# EAGLE design 211_7seg_1_0_7 (EAGLE 9.2.2)
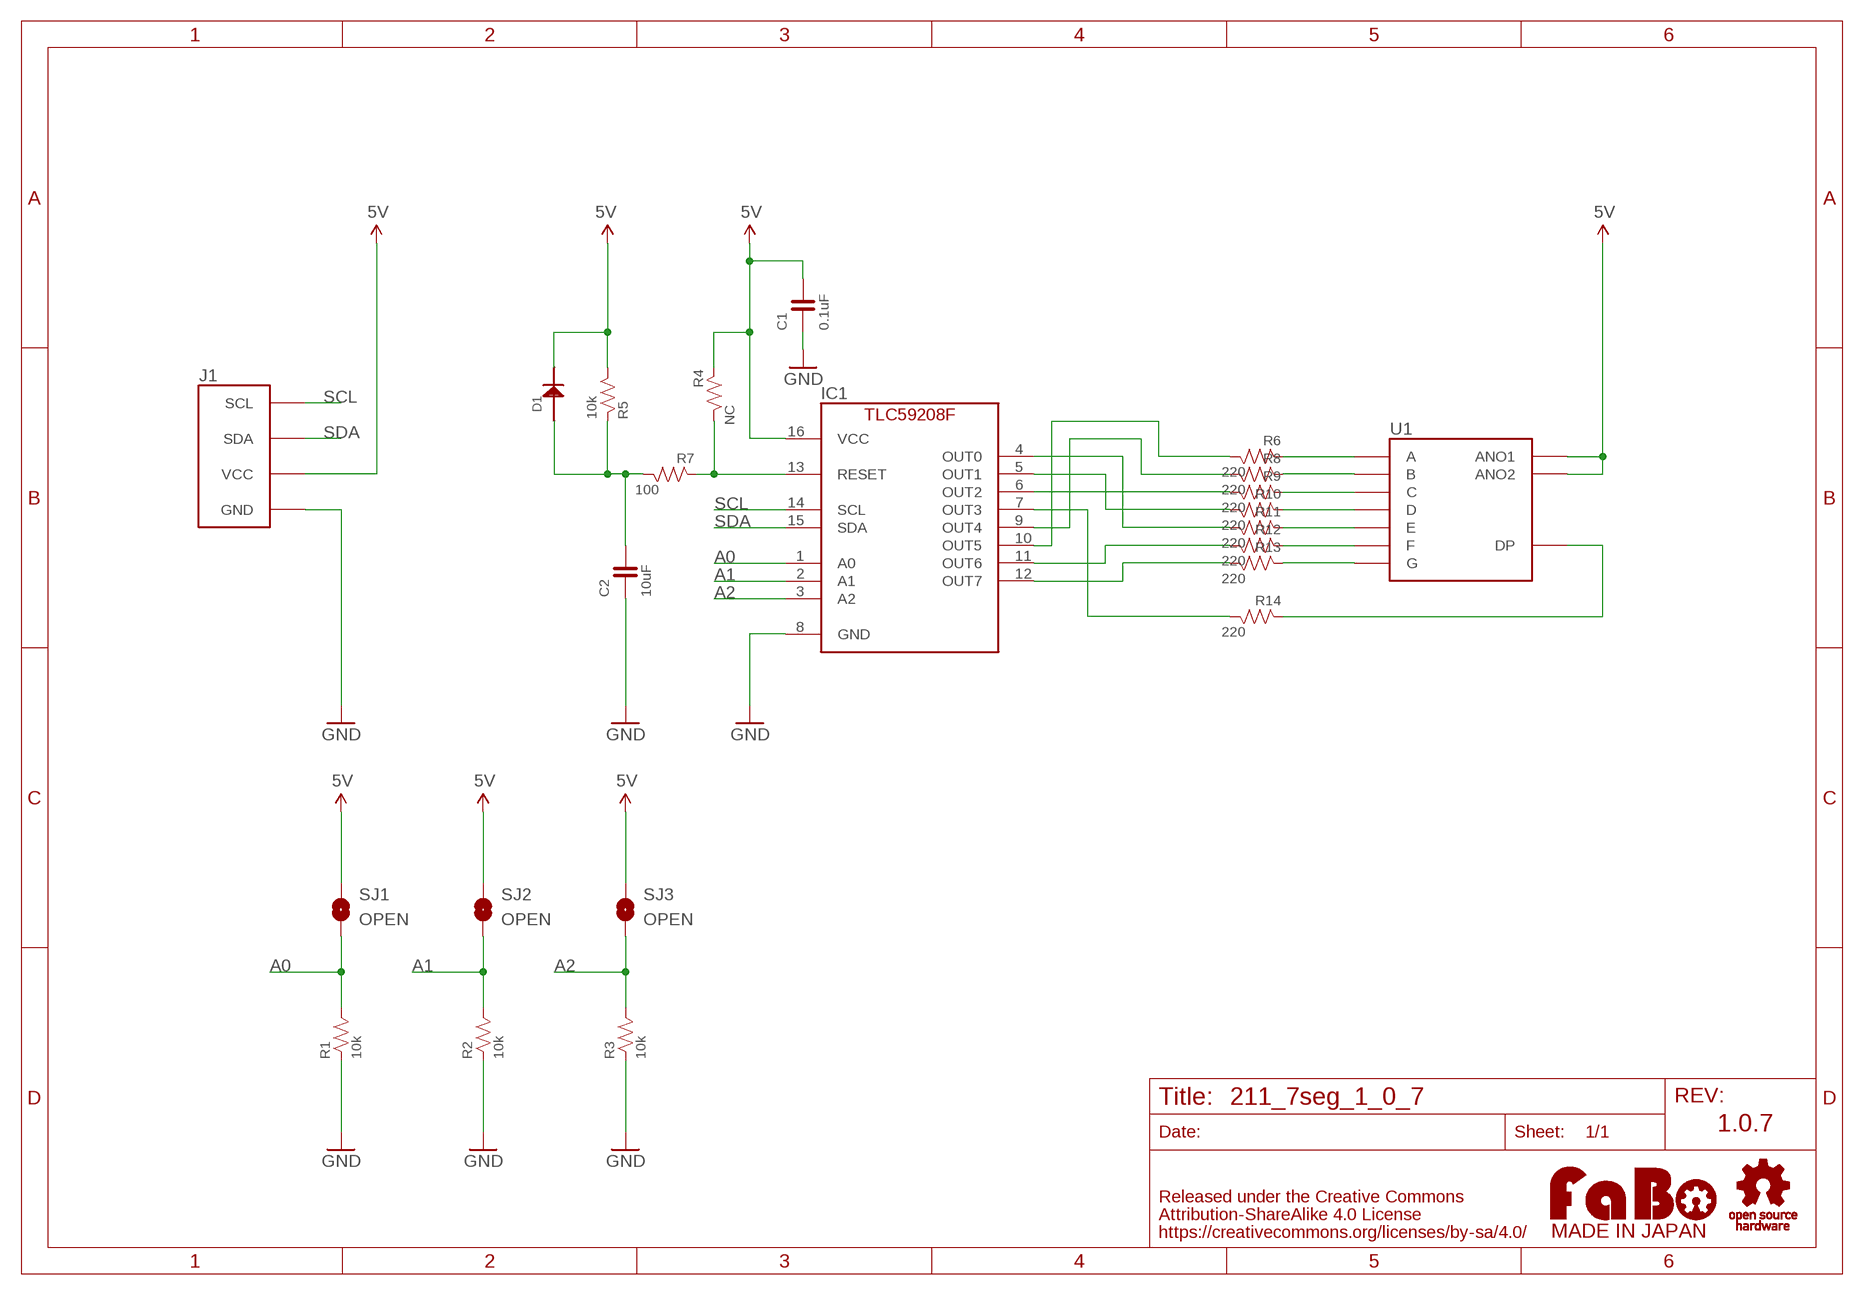
[diagram p0: schematic, sheet 1]

## Parts
C1  0.1uF  CAPACITOR-0603  [0603]
C2  10uF  CAPACITOR-0603  [0603]
D1  1N4148  [1N4148W]
IC1  TLC59208FIPWR  [TSSOP16]
J1  FABO_BRICK_I2C  [FABO_BRICK_I2C]
R1  10k  RESISTOR-0603  [0603]
R2  10k  RESISTOR-0603  [0603]
R3  10k  RESISTOR-0603  [0603]
R4  NC  RESISTOR-0603  [0603]
R5  10k  RESISTOR-0603  [0603]
R6  220  RESISTOR-0603  [0603]
R7  100  RESISTOR-0603  [0603]
R8  220  RESISTOR-0603  [0603]
R9  220  RESISTOR-0603  [0603]
R10  220  RESISTOR-0603  [0603]
R11  220  RESISTOR-0603  [0603]
R12  220  RESISTOR-0603  [0603]
R13  220  RESISTOR-0603  [0603]
R14  220  RESISTOR-0603  [0603]
SJ1  OPEN  SMD-JUMPER-2-OPEN  [SMD-JUMPER-2-OPEN]
SJ2  OPEN  SMD-JUMPER-2-OPEN  [SMD-JUMPER-2-OPEN]
SJ3  OPEN  SMD-JUMPER-2-OPEN  [SMD-JUMPER-2-OPEN]
U1  7SEG_ANO  [A-551SRD]
U$2  LOGO_OSHW-M_BOTTOM  [LOGO_OSHW_M_BOTTOM]
U$4  LOGO_FABO-M  [LOGO_FABO_MS]

## Nets
5V: C1.2 D1.CATHODE IC1.16(VCC) J1.VCC R4.1 R5.2 SJ1.1 SJ2.1 SJ3.1 U1.ANO1 U1.ANO2
A0: IC1.1(A0) R1.2 SJ1.2
A1: IC1.2(A1) R2.2 SJ2.2
A2: IC1.3(A2) R3.2 SJ3.2
GND: C1.1 C2.1 IC1.8(GND) J1.GND R1.1 R2.1 R3.1
N$1: IC1.4(OUT0) R11.2
N$2: IC1.5(OUT1) R10.2
N$3: R9.1 U1.C
N$4: IC1.7(OUT3) R14.2
N$5: IC1.9(OUT4) R8.2
N$6: IC1.10(OUT5) R6.2
N$7: IC1.11(OUT6) R12.2
N$8: IC1.12(OUT7) R13.2
N$9: C2.2 D1.ANODE R5.1 R7.2
N$10: IC1.13(RESET) R4.2 R7.1
N$11: R6.1 U1.A
N$12: R8.1 U1.B
N$13: IC1.6(OUT2) R9.2
N$14: R10.1 U1.D
N$15: R11.1 U1.E
N$16: R12.1 U1.F
N$17: R13.1 U1.G
N$18: R14.1 U1.DP
SCL: IC1.14(SCL) J1.SCL
SDA: IC1.15(SDA) J1.SDA

## Notes on the sheet
- 1.0.7

## Library data of the parts
C1 C2 = FaBo-Capacitor:CAPACITOR: CAPACITOR
D1 = FaBo-Diode:1N4148
IC1 = FaBo-LED:TLC59208F
J1 = FaBo-Template:FABO_BRICK_I2C: FaBo Brick I2C
R1-R14 = FaBo-Resistors:RESISTOR: RESISTOR
SJ1-SJ3 = FaBo-Supply:SMD-JUMPER-2
U1 = FaBo-LED:7SEG_ANO
U$2 = FaBo-etc:LOGO_OSHW
U$4 = FaBo-etc:LOGO_FABO

## Board
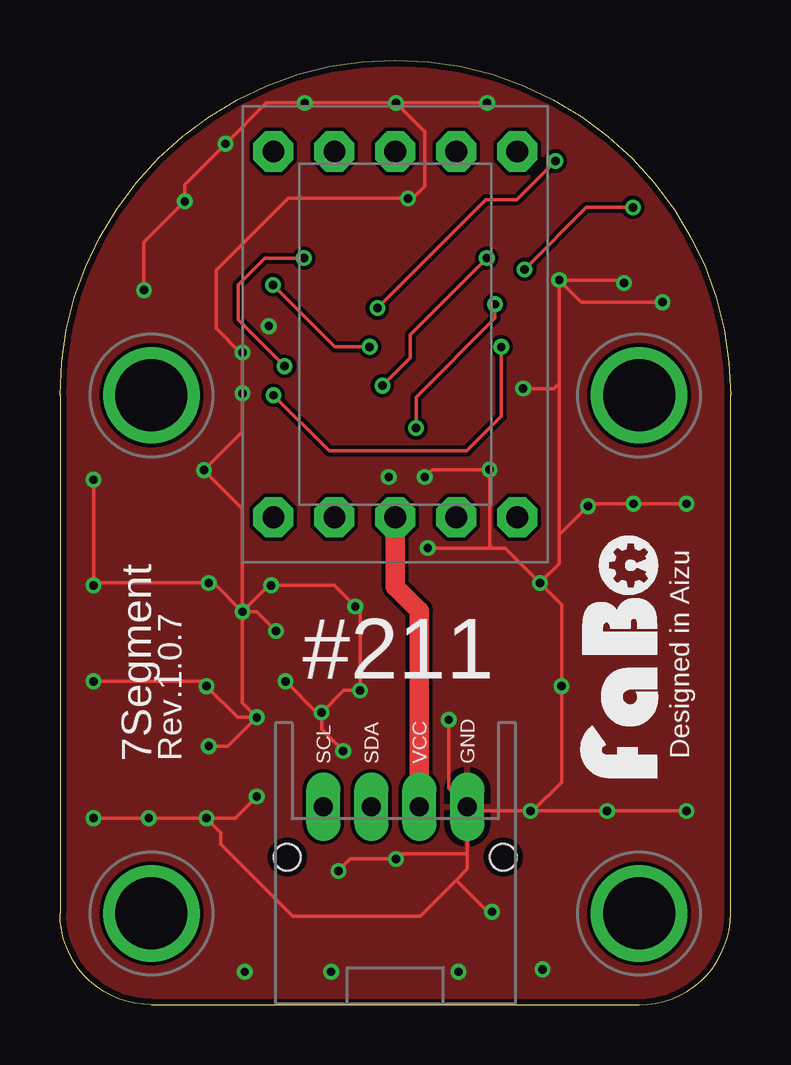
[diagram p1: board, top side]
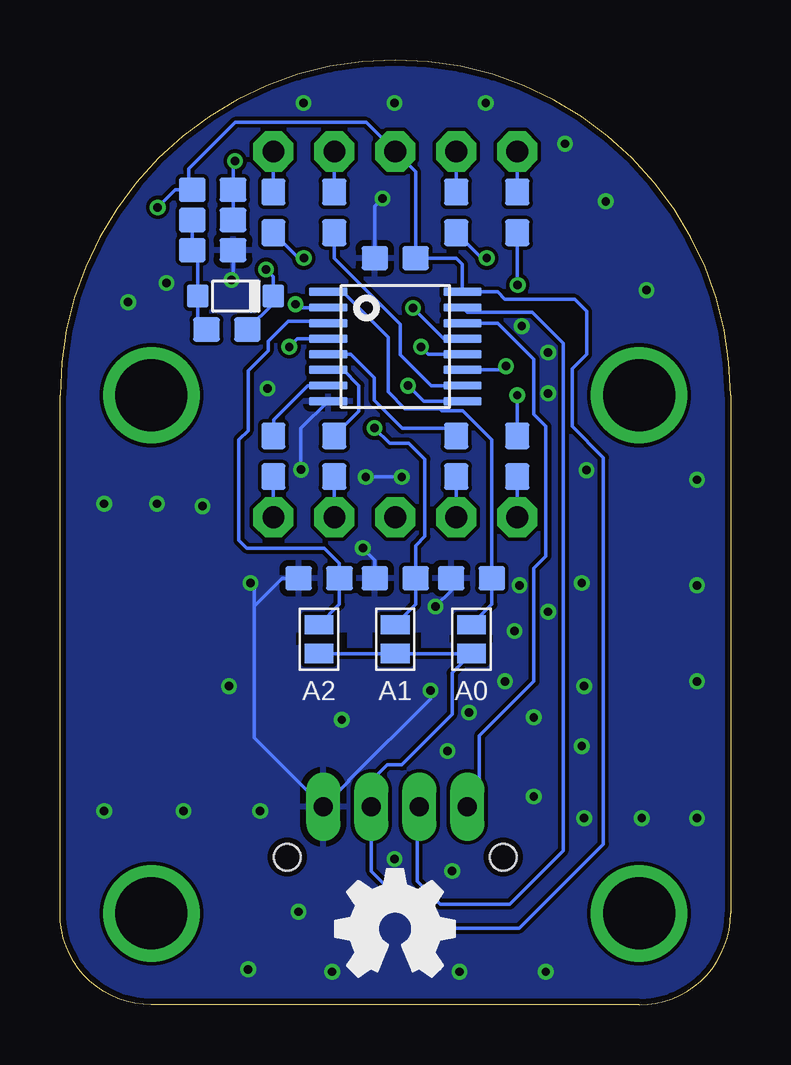
[diagram p2: board, bottom side, seen from below]

Size 27.94 x 39.37 mm. Coordinates in mm from the lower left corner, seen from the top.
Copper layers (1*16): Top 0.035mm / dielectric 1.5mm / Bottom 0.035mm
Design rules "SeeedStudio_2layer_DRU_no_angle_20140221": minimum track width 6mil, minimum drill 12mil, track to track 6mil, track to pad 6mil, pad to pad 6mil, via to via 6mil, smd to smd 0mil, copper to edge 10mil, drill to drill 10mil, minimum pad ring 10mil, minimum via ring 6mil, stop-mask expansion 2mil, vias tented up to drill 100mil, thermal gap 10mil
bRestrict: area 9.9,15.1 to 10.1,15.4; area 11.5,15.1 to 11.7,15.4; area 12.9,15 to 13.3,15.5; area 14.6,15 to 14.9,15.5; area 16,15 to 16.5,15.5; area 17.8,15 to 18.1,15.5

### Footprints (pad centres in the part's own frame; a part is rotated, then mirrored left to right if it is on the bottom)
0603 = smd 1.1 x 1: 1 -0.85,0; 2 0.85,0
1N4148W = smd 0.9 x 0.95: ANODE 0,0; CATHODE 3.15,0
TSSOP16 = smd 0.35 x 1.6: 1 -2.275,-2.8; 2 -1.625,-2.8; 3 -0.975,-2.8; 4 -0.325,-2.8; 5 0.325,-2.8; 6 0.975,-2.8; 7 1.625,-2.8; 8 2.275,-2.8; 9 2.275,2.8; 10 1.625,2.8; 11 0.975,2.8; 12 0.325,2.8; 13 -0.325,2.8; 14 -0.975,2.8; 15 -1.625,2.8; 16 -2.275,2.8
FABO_BRICK_I2C = drill 0.8 pad 1.422 long: GND 3,-10.795; SCL -3,-10.795; SDA -1,-10.795; VCC 1,-10.795 | drill 3 pad 3.81: P$1 -10.16,6.35; P$2 10.16,6.35; P$3 -10.16,-15.24; P$4 10.16,-15.24 | hole 1.1: -4.5,-12.895; 4.5,-12.895
SMD-JUMPER-2-OPEN = smd 0.8 x 1.2: 1 -0.6,0; 2 0.6,0
A-551SRD = drill 0.9 pad 1.676 octagon: A 2.54,7.62; ANO1 0,-7.62; ANO2 0,7.62; B 5.08,7.62; C 2.54,-7.62; D -2.54,-7.62; DP 5.08,-7.62; E -5.08,-7.62; F -2.54,7.62; G -5.08,7.62

### Placement (x,y rotation side)
C1  13.97,31.11 0 bottom
C2  21.58,31.45 180 bottom
D1  22.2,29.53 0 bottom
IC1  13.97,27.43 270 bottom
J1  13.97,19.05 0 top
R1  10.79,17.78 0 bottom
R2  13.97,17.78 0 bottom
R3  17.14,17.78 0 bottom
R4  21.58,33.97 0 bottom
R5  20.99,28.14 0 bottom
R6  16.51,33.02 270 bottom
R7  21.58,32.71 180 bottom
R8  19.05,33.02 270 bottom
R9  16.51,22.86 90 bottom
R10  11.43,22.86 90 bottom
R11  8.89,22.86 90 bottom
R12  11.43,33.02 270 bottom
R13  8.89,33.02 270 bottom
R14  19.05,22.86 90 bottom
SJ1  10.79,15.24 90 bottom
SJ2  13.97,15.24 90 bottom
SJ3  17.14,15.24 90 bottom
U1  13.97,27.94 0 top
U$2  13.97,3.17 0 top
U$4  25.3,14.51 90 top

### Tracks (layer width: path | path; a pad name or v marks a point on that pad's centre or on a via)
5V  (via drill 0.35)
  Top 0.152: v19.36,30.64 21.93,33.23 v23.87,33.23
  Top 0.813: J1.VCC 14.97,16.43 13.97,17.43 U1.ANO1
  Bottom 0.152: v19.36,30.64 19.05,30.34 D1.CATHODE 19.05,29.22 R5.2 | v23.87,33.23 23.13,33.97 22.58,33.97 | 22.58,33.97 R4.1 | 22.58,33.97 22.58,34.84 20.64,36.77 15.18,36.77 U1.ANO2 13.12,34.71 C1.2 11.43,31.11 11.17,30.86 IC1.16 9.71,29.71 9.4,29.4 6.5,29.4 6,28.9 6,27.1 6.6,26.5 6.6,24.1 5.3,22.8 5.3,6.7 8.8,3.2 12.6,3.2 14.97,5.57 J1.VCC 14.97,9.33 14.3,10 13.7,10 11.6,12.1 11.6,13.84 SJ1.1 SJ2.1 SJ3.1
A0
  Bottom 0.152: SJ1.2 9.95,16.69 R1.2 9.95,19.87 9.96,19.88 9.96,23.55 11.16,24.75 12.03,24.75 12.12,24.84 13.56,24.84 14.27,25.54 14.27,27.82 16.15,29.71 IC1.1
A1  (via drill 0.35)
  Top 0.152: v14.84,24.03 14.84,25.32 18.12,28.61 v18.12,29.19
  Bottom 0.152: SJ2.2 13.12,16.69 R2.2 13.12,19.14 12.74,19.52 12.74,22.73 13.41,23.4 14.21,23.4 v14.84,24.03 | v18.12,29.19 17.99,29.06 IC1.2
A2
  Bottom 0.152: SJ3.2 16.3,16.69 R3.2 16.3,18.39 16.93,19.03 20.16,19.03 20.48,19.36 20.48,23.55 20.1,23.93 20.1,26.41 19.27,27.25 19.27,27.65 18.43,28.48 16.85,28.48 IC1.3
GND  (via drill 0.35)
  Top 0.152: v15.32,19.03 18,19.03 | 18,19.03 18.55,19.03 v20,17.58 | 16.97,6.3 16.97,5.67 16.5,5.2 | 16.97,6.3 J1.GND | 16.5,5.2 15,3.7 9.7,3.7 6.7,6.7 6.7,7.18 v6.1,7.78 | 18,19.03 17.9,19.13 v17.9,22.3 15.5,22.3 v15.2,22 | v20.8,30.2 20.8,25.9 | 20.8,25.9 20.8,19.58 | 20.8,19.58 20.8,18.38 v20,17.58 | v7.6,16.38 7.6,20.68 v6,22.28 7.6,23.88 v7.6,25.48 v7.6,27.18 7.52,27.18 6.5,28.2 6.5,30.6 9.5,33.6 v14.5,33.6 14.7,33.6 15.2,34.1 15.2,36.4 15.18,36.4 v14,37.58 | v7.6,16.38 8.7,17.48 v8.8,17.48 11.42,17.48 v12.3,16.6 12.5,16.4 v12.5,13.1 11.82,13.1 v10.9,12.18 | v7.6,16.38 8.2,16.38 v9,15.58 | v8.2,11.98 7.6,12.58 v7.6,16.38 | v11.8,10.58 10.9,11.48 v10.9,12.18 | v9.4,13.48 10.7,12.18 v10.9,12.18 | v6.2,10.78 7,10.78 v8.2,11.98 | v8.2,11.98 7.4,11.98 v6.1,13.28 5.9,13.48 v1.4,13.48 | v7.6,16.38 6.4,17.58 v6.2,17.58 1.5,17.58 v1.4,17.48 v1.4,21.88 | v1.4,7.78 v3.7,7.78 v6.1,7.78 | v6.1,7.78 7.3,7.78 v8.2,8.68 | v11.6,5.58 12.1,6.08 v14,6.08 14.22,6.3 16.97,6.3 | v18,3.88 17.82,3.88 16.5,5.2 | J1.GND 16.2,9.03 v16.2,11.88 | J1.GND 17.14,8.08 v19.6,8.08 19.7,8.08 | 19.7,8.08 v22.8,8.08 v26.1,8.08 | 20.8,19.58 v22,20.78 22.1,20.88 v23.9,20.88 v26.1,20.88 | v3.5,29.78 3.5,31.78 v5.2,33.48 5.2,34.18 v6.9,35.88 8.6,37.58 v10.2,37.58 v14,37.58 | v14,37.58 v17.8,37.58 | v20.8,30.2 21.72,29.28 v25.1,29.28 | v20.8,30.2 23.38,30.2 v23.5,30.08 | v20,17.58 20.9,16.68 v20.9,13.28 20.9,9.28 19.7,8.08 | v19.3,25.68 20.58,25.68 20.8,25.9
  Bottom 0.152: R3.1 18.67,17.78 19.84,16.61 | 19.84,16.61 19.84,11.12 J1.GND 15.91,9.31 15.91,9.36 12.5,12.77 v12.5,13.1 | R2.1 14.82,18.53 v15.32,19.03 | v20,17.58 19.84,17.42 19.84,16.61 | C1.1 14.82,33.28 v14.5,33.6 | v12.3,16.6 11.64,17.25 R1.1 | IC1.8 17.9,24.03 v17.9,22.3 | C2.1 20.73,30.27 v20.8,30.2 | v13.7,22 v15.2,22
  other vias: 8.7,28.28 7.7,1.38 11.3,1.38 16.6,1.38 20.1,1.48
  pour Bottom: 0,0 27.94,0 27.94,39.37 0,39.37
  pour Top: 0,0 27.94,0 27.94,39.37 0,39.37
N$1  (via drill 0.35)
  Top 0.152: v8.89,25.4 11.21,23.08 16.95,23.08 18.39,24.52 v18.39,27.42
  Bottom 0.152: R11.2 v8.89,25.4 | v18.39,27.42 18.05,27.76 IC1.4
N$2
  Bottom 0.152: R10.2 11.74,24.02 13.67,24.02 14.84,25.18 14.84,26.13 15.82,27.11 IC1.5
N$3
  Bottom 0.152: U1.C R9.1
N$4
  Bottom 0.152: R14.2 19.03,23.73 19.03,24.38 17.61,25.81 IC1.7
N$5  (via drill 0.35)
  Top 0.152: v17.78,31.11 14.6,27.93 14.6,26.96 v13.44,25.8
  Bottom 0.152: R8.2 18,31.11 v17.78,31.11 | v13.44,25.8 12.79,25.16 IC1.9
N$6
  Bottom 0.152: R6.2 16.51,31.11 13.76,28.36 13.76,27.09 12.47,25.81 IC1.10
N$7  (via drill 0.35)
  Top 0.152: v9.36,26.61 7.42,28.55 7.42,30 8.53,31.11 v10.16,31.11
  Bottom 0.152: R12.2 10.38,31.11 v10.16,31.11 | IC1.11 9.51,26.46 v9.36,26.61
N$8  (via drill 0.35)
  Top 0.152: v8.87,30 11.45,27.42 v12.9,27.42
  Bottom 0.152: R13.2 8.89,30.02 v8.87,30 | v12.9,27.42 12.59,27.11 IC1.12
N$9
  Bottom 0.152: R7.2 C2.2 22.2,31.22 D1.ANODE 22.2,28.51 R5.1
N$10  (via drill 0.35)
  Top 0.152: v13.23,29.03 17.74,33.55 19.03,33.55 v20.64,35.16
  Bottom 0.152: IC1.13 11.95,27.76 v13.23,29.03 | v20.64,35.16 20.73,35.08 R4.2 R7.1
N$11
  Bottom 0.152: R6.1 U1.A
N$12
  Bottom 0.152: R8.1 U1.B
N$13
  Bottom 0.152: R9.2 15.48,24.74 15.48,25.81 16.13,26.46 IC1.6
N$14
  Bottom 0.152: U1.D R10.1
N$15
  Bottom 0.152: R11.1 U1.E
N$16
  Bottom 0.152: U1.F R12.1
N$17
  Bottom 0.152: R13.1 U1.G
N$18
  Bottom 0.152: U1.DP R14.1
SCL
  Bottom 0.152: J1.SCL 10.47,8.76 10.47,11.21 8.2,13.48 8.2,18.2 7.7,18.7 7.7,24.1 8.2,24.6 8.2,26.9 9.71,28.41 IC1.14
SDA
  Bottom 0.152: IC1.15 10.97,28.86 8.27,28.86 6.97,27.56 6.97,6.41 9.19,4.19 12.1,4.19 13.06,5.16 13.06,8.16 J1.SDA

### Text on the board
tPlace: Designed in Aizu | #211 | 7Segment | Rev.1.0.7
bPlace: A0 | A1 | A2